# Altium schematic sheet DSP_GPIO_Part4.SchDoc
size A4
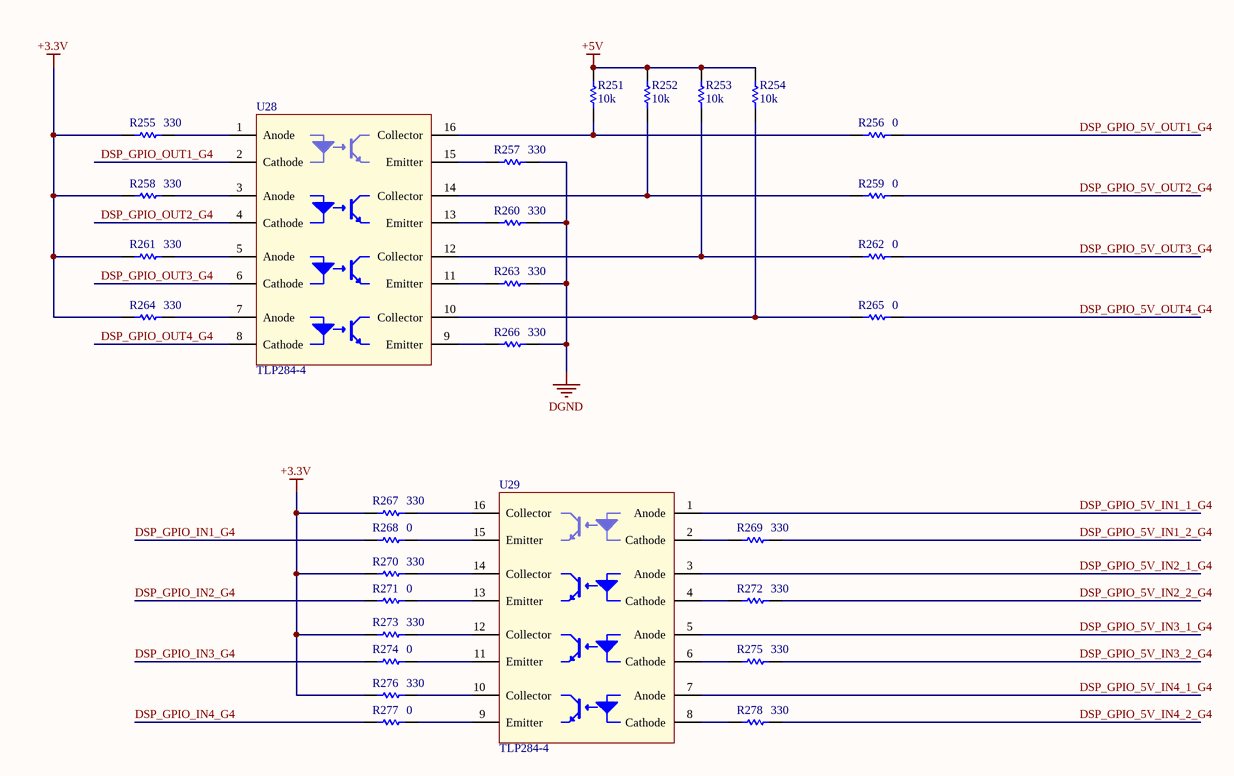
[diagram p0: DSP_GPIO_Part4.SchDoc]

## Parts
R251  value 10k  [1608[0603]]  (hidden comment: Res1)
R252  value 10k  [1608[0603]]  (hidden comment: Res1)
R253  value 10k  [1608[0603]]  (hidden comment: Res1)
R254  value 10k  [1608[0603]]  (hidden comment: Res1)
R255  value 330  [1608[0603]]  (hidden comment: Res1)
R256  value 0  [1608[0603]]  (hidden comment: Res1)
R257  value 330  [1608[0603]]  (hidden comment: Res1)
R258  value 330  [1608[0603]]  (hidden comment: Res1)
R259  value 0  [1608[0603]]  (hidden comment: Res1)
R260  value 330  [1608[0603]]  (hidden comment: Res1)
R261  value 330  [1608[0603]]  (hidden comment: Res1)
R262  value 0  [1608[0603]]  (hidden comment: Res1)
R263  value 330  [1608[0603]]  (hidden comment: Res1)
R264  value 330  [1608[0603]]  (hidden comment: Res1)
R265  value 0  [1608[0603]]  (hidden comment: Res1)
R266  value 330  [1608[0603]]  (hidden comment: Res1)
R267  value 330  [1608[0603]]  (hidden comment: Res1)
R268  value 0  [1608[0603]]  (hidden comment: Res1)
R269  value 330  [1608[0603]]  (hidden comment: Res1)
R270  value 330  [1608[0603]]  (hidden comment: Res1)
R271  value 0  [1608[0603]]  (hidden comment: Res1)
R272  value 330  [1608[0603]]  (hidden comment: Res1)
R273  value 330  [1608[0603]]  (hidden comment: Res1)
R274  value 0  [1608[0603]]  (hidden comment: Res1)
R275  value 330  [1608[0603]]  (hidden comment: Res1)
R276  value 330  [1608[0603]]  (hidden comment: Res1)
R277  value 0  [1608[0603]]  (hidden comment: Res1)
R278  value 330  [1608[0603]]  (hidden comment: Res1)
U28  TLP284-4  [TLP284-4]
U29  TLP284-4  [TLP284-4]

## Nets
+3.3V: R255.1 R258.1 R261.1 R264.1 R267.1 R270.1 R273.1 R276.1
+5V: R251.2 R252.2 R253.2 R254.2
DGND: R257.2 R260.2 R263.2 R266.2
DSP_GPIO_5V_IN1_1_G4: U29.1(Anode)
DSP_GPIO_5V_IN1_2_G4: R269.2
DSP_GPIO_5V_IN2_1_G4: U29.3(Anode)
DSP_GPIO_5V_IN2_2_G4: R272.2
DSP_GPIO_5V_IN3_1_G4: U29.5(Anode)
DSP_GPIO_5V_IN3_2_G4: R275.2
DSP_GPIO_5V_IN4_1_G4: U29.7(Anode)
DSP_GPIO_5V_IN4_2_G4: R278.2
DSP_GPIO_5V_OUT1_G4: R256.2
DSP_GPIO_5V_OUT2_G4: R259.2
DSP_GPIO_5V_OUT3_G4: R262.2
DSP_GPIO_5V_OUT4_G4: R265.2
DSP_GPIO_IN1_G4: R268.1
DSP_GPIO_IN2_G4: R271.1
DSP_GPIO_IN3_G4: R274.1
DSP_GPIO_IN4_G4: R277.1
DSP_GPIO_OUT1_G4: U28.2(Cathode)
DSP_GPIO_OUT2_G4: U28.4(Cathode)
DSP_GPIO_OUT3_G4: U28.6(Cathode)
DSP_GPIO_OUT4_G4: U28.8(Cathode)
NetR251_1: R251.1 R256.1 U28.16(Collector)
NetR252_1: R252.1 R259.1 U28.14(Collector)
NetR253_1: R253.1 R262.1 U28.12(Collector)
NetR254_1: R254.1 R265.1 U28.10(Collector)
NetR255_2: R255.2 U28.1(Anode)
NetR257_1: R257.1 U28.15(Emitter)
NetR258_2: R258.2 U28.3(Anode)
NetR260_1: R260.1 U28.13(Emitter)
NetR261_2: R261.2 U28.5(Anode)
NetR263_1: R263.1 U28.11(Emitter)
NetR264_2: R264.2 U28.7(Anode)
NetR266_1: R266.1 U28.9(Emitter)
NetR267_2: R267.2 U29.16(Collector)
NetR268_2: R268.2 U29.15(Emitter)
NetR269_1: R269.1 U29.2(Cathode)
NetR270_2: R270.2 U29.14(Collector)
NetR271_2: R271.2 U29.13(Emitter)
NetR272_1: R272.1 U29.4(Cathode)
NetR273_2: R273.2 U29.12(Collector)
NetR274_2: R274.2 U29.11(Emitter)
NetR275_1: R275.1 U29.6(Cathode)
NetR276_2: R276.2 U29.10(Collector)
NetR277_2: R277.2 U29.9(Emitter)
NetR278_1: R278.1 U29.8(Cathode)

## Library data of the parts
R251-R278 = Res1: Resistor; Published: 8-Jun-2000; LatestRevisionDate: 17-Jul-2002; LatestRevisionNote: Re-released for DXP Platform.; PackageReference: AXIAL-0.3; Publisher: Altium Limited; PackageDescription: Axial Device, Thru-Hole; 2 Leads; 0.3 in Pin Spacing